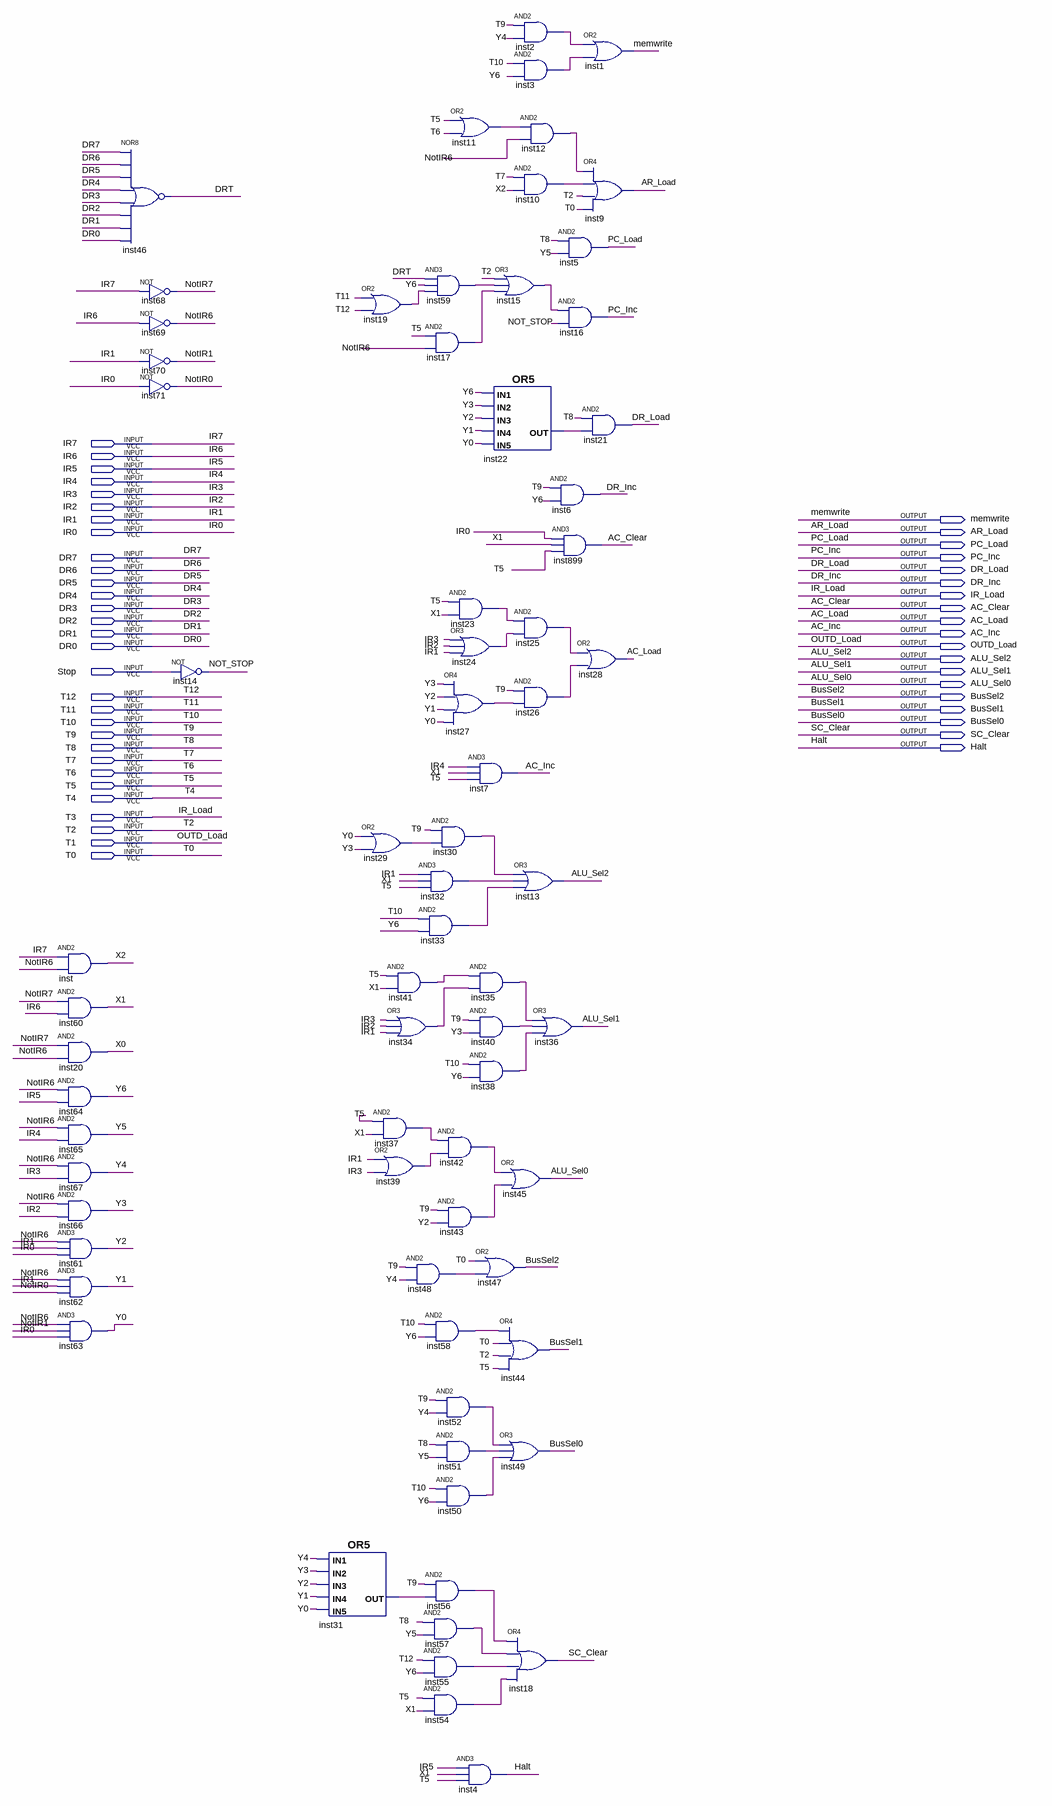
[diagram p0: schematic sheet]
// Quartus schematic lab3controller.bdf as structural Verilog: 71 symbols, 49 pins
module lab3controller (
  input  IR7,
  input  IR6,
  input  IR5,
  input  IR4,
  input  IR3,
  input  IR2,
  input  IR1,
  input  IR0,
  input  DR7,
  input  DR6,
  input  DR5,
  input  DR4,
  input  DR3,
  input  DR2,
  input  DR1,
  input  DR0,
  input  Stop,
  input  T12,
  input  T11,
  input  T10,
  input  T9,
  input  T8,
  input  T7,
  input  T6,
  input  T5,
  input  T4,
  input  T3,
  input  T2,
  input  T1,
  input  T0,
  output memwrite,
  output AR_Load,
  output PC_Load,
  output PC_Inc,
  output DR_Load,
  output DR_Inc,
  output IR_Load,
  output AC_Clear,
  output AC_Load,
  output AC_Inc,
  output OUTD_Load,
  output ALU_Sel2,
  output ALU_Sel1,
  output ALU_Sel0,
  output BusSel2,
  output BusSel1,
  output BusSel0,
  output SC_Clear,
  output Halt
);

  wire DRT, inst2_out, inst3_out, inst10_out, inst11_out, inst12_out, inst15_out, inst17_out, inst19_out,
       inst22_out, inst23_out, inst24_out, inst25_out, inst26_out, inst27_out, inst29_out, inst30_out,
       inst31_out, inst32_out, inst33_out, inst34_out, inst35_out, inst37_out, inst38_out, inst39_out,
       inst40_out, inst41_out, inst42_out, inst43_out, inst48_out, inst50_out, inst51_out, inst52_out,
       inst54_out, inst55_out, inst56_out, inst57_out, inst58_out, inst59_out, NOT_STOP, NotIR0, NotIR1,
       NotIR6, NotIR7, X0, X1, X2, Y0, Y1, Y2, Y3, Y4, Y5, Y6;

  and inst (X2, IR7, NotIR6);
  and inst60 (X1, NotIR7, IR6);
  and inst20 (X0, NotIR7, NotIR6);
  and inst64 (Y6, NotIR6, IR5);
  and inst65 (Y5, NotIR6, IR4);
  and inst67 (Y4, NotIR6, IR3);
  and inst66 (Y3, NotIR6, IR2);
  and inst61 (Y2, NotIR6, IR1, IR0);
  and inst62 (Y1, NotIR6, IR1, NotIR0);
  and inst63 (Y0, NotIR6, NotIR1, IR0);
  nor inst46 (DRT, DR7, DR6, DR5, DR4, DR3, DR2, DR1, DR0);
  not inst68 (NotIR7, IR7);
  not inst69 (NotIR6, IR6);
  not inst70 (NotIR1, IR1);
  not inst71 (NotIR0, IR0);
  not inst14 (NOT_STOP, Stop);
  or inst19 (inst19_out, T11, T12);
  or inst29 (inst29_out, Y0, Y3);
  or inst31 (inst31_out, Y4, Y3, Y2, Y1, Y0);
  and inst41 (inst41_out, T5, X1);
  or inst34 (inst34_out, IR3, IR2, IR1);
  and inst37 (inst37_out, T5, X1);
  or inst39 (inst39_out, IR1, IR3);
  and inst48 (inst48_out, T9, Y4);
  or inst11 (inst11_out, T5, T6);
  and inst59 (inst59_out, DRT, Y6, inst19_out);
  and inst17 (inst17_out, T5, NotIR6);
  and inst23 (inst23_out, T5, X1);
  or inst24 (inst24_out, IR3, IR2, IR1);
  or inst27 (inst27_out, Y3, Y2, Y1, Y0);
  and inst7 (AC_Inc, IR4, X1, T5);
  and inst30 (inst30_out, T9, inst29_out);
  and inst32 (inst32_out, IR1, X1, T5);
  and inst33 (inst33_out, T10, Y6);
  and inst42 (inst42_out, inst37_out, inst39_out);
  and inst43 (inst43_out, T9, Y2);
  and inst58 (inst58_out, T10, Y6);
  and inst52 (inst52_out, T9, Y4);
  and inst51 (inst51_out, T8, Y5);
  and inst50 (inst50_out, T10, Y6);
  and inst56 (inst56_out, T9, inst31_out);
  and inst57 (inst57_out, T8, Y5);
  and inst55 (inst55_out, T12, Y6);
  and inst54 (inst54_out, T5, X1);
  and inst4 (Halt, IR5, X1, T5);
  and inst2 (inst2_out, T9, Y4);
  and inst3 (inst3_out, T10, Y6);
  and inst10 (inst10_out, T7, X2);
  or inst15 (inst15_out, T2, inst59_out, inst17_out);
  or inst22 (inst22_out, Y6, Y3, Y2, Y1, Y0);
  and inst25 (inst25_out, inst23_out, inst24_out);
  and inst26 (inst26_out, T9, inst27_out);
  or inst13 (ALU_Sel2, inst30_out, inst32_out, inst33_out);
  and inst35 (inst35_out, inst41_out, inst34_out);
  and inst40 (inst40_out, T9, Y3);
  and inst38 (inst38_out, T10, Y6);
  or inst45 (ALU_Sel0, inst42_out, inst43_out);
  or inst47 (BusSel2, T0, inst48_out);
  or inst44 (BusSel1, inst58_out, T0, T2, T5);
  or inst49 (BusSel0, inst52_out, inst51_out, inst50_out);
  or inst18 (SC_Clear, inst56_out, inst57_out, inst55_out, inst54_out);
  and inst12 (inst12_out, inst11_out, NotIR6);
  and inst5 (PC_Load, T8, Y5);
  and inst16 (PC_Inc, inst15_out, NOT_STOP);
  and inst6 (DR_Inc, T9, Y6);
  and inst899 (AC_Clear, IR0, X1, T5);
  or inst36 (ALU_Sel1, inst35_out, inst40_out, inst38_out);
  or inst1 (memwrite, inst2_out, inst3_out);
  or inst9 (AR_Load, inst12_out, inst10_out, T2, T0);
  and inst21 (DR_Load, T8, inst22_out);
  or inst28 (AC_Load, inst25_out, inst26_out);

  assign IR_Load = T3;
  assign OUTD_Load = T1;
endmodule
